# Altium schematic sheet DigitHolder.SCHDOC
size A4; DocumentNumber: 6; SheetNumber: 6; SheetTotal: 7
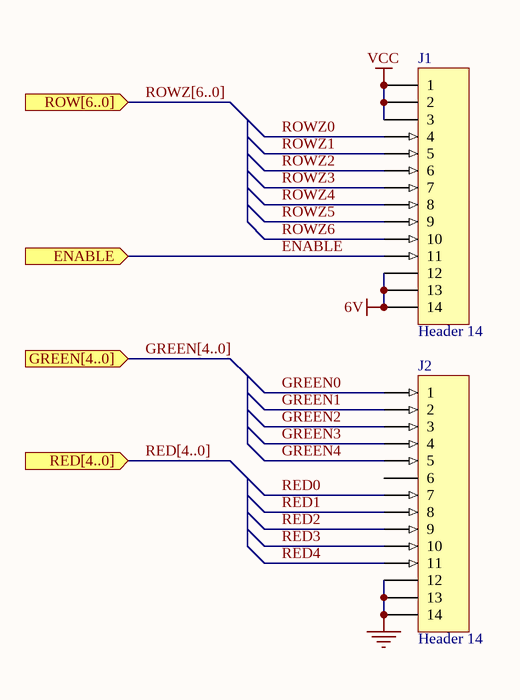
[diagram p0: DigitHolder.SCHDOC]

## Parts
J1  Header 14  [HDR1X14]
J2  Header 14  [HDR1X14]

## Ports
ENABLE (in), GREEN[4..0] (in), RED[4..0] (in), ROW[6..0] (in)

## Nets
6V: J1.12 J1.13 J1.14
GND: J2.12 J2.13 J2.14
VCC: J1.1 J1.2 J1.3
ENABLE: J1.11 ; port ENABLE
GREEN0: J2.1
GREEN1: J2.2
GREEN2: J2.3
GREEN3: J2.4
GREEN4: J2.5
RED0: J2.7
RED1: J2.8
RED2: J2.9
RED3: J2.10
RED4: J2.11
ROWZ0: J1.4
ROWZ1: J1.5
ROWZ2: J1.6
ROWZ3: J1.7
ROWZ4: J1.8
ROWZ5: J1.9
ROWZ6: J1.10

Not connected (* = marked no-connect by the designer): J2 6

## Buses and harness runs
bus GREEN[4..0] = port GREEN[4..0]
bus RED[4..0] = port RED[4..0]
bus ROWZ[6..0] = port ROW[6..0]

## Library data of the parts
J1 J2 = Header 14: Header, 14-Pin; Manufacturer: Generic Components; Class I: Connector; Revision: July-2002: Re-released for DXP Platform.; Publisher: Altium Limited